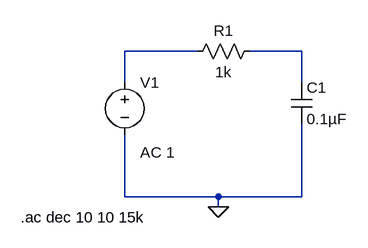
[diagram p0: schematic Draft44.asc]
Draft44.asc, the LTspice schematic file:
Version 4
SHEET 1 880 680
WIRE 128 128 16 128
WIRE 288 128 208 128
WIRE 16 176 16 128
WIRE 288 176 288 128
WIRE 16 352 16 256
WIRE 160 352 16 352
WIRE 288 352 288 240
WIRE 288 352 160 352
WIRE 160 368 160 352
FLAG 160 368 0
SYMBOL res 224 112 R90
WINDOW 0 0 56 VBottom 2
WINDOW 3 32 56 VTop 2
SYMATTR InstName R1
SYMATTR Value 1k
SYMBOL voltage 16 160 R0
WINDOW 123 24 124 Left 2
WINDOW 39 0 0 Left 0
SYMATTR InstName V1
SYMATTR Value ""
SYMATTR Value2 AC 1
SYMBOL cap 272 176 R0
SYMATTR InstName C1
SYMATTR Value 0.1µF
TEXT -144 384 Left 2 !.ac dec 10 10 15k

The netlist it stands for:
* Draft44.asc
R1 N002 N001 1k
V1 N001 0 AC 1
C1 N002 0 0.1µF
.ac dec 10 10 15k
.backanno
.end